# Altium schematic sheet Barrido doble de fuente DC.SchDoc
size A4
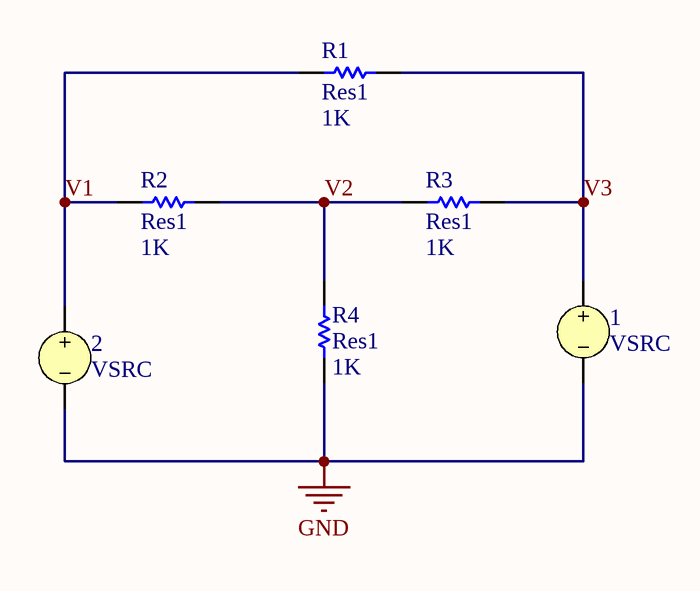
[diagram p0: Barrido doble de fuente DC.SchDoc]

## Parts
1  VSRC
2  VSRC
R1  Res1  value 1K  [AXIAL-0.3]
R2  Res1  value 1K  [AXIAL-0.3]
R3  Res1  value 1K  [AXIAL-0.3]
R4  Res1  value 1K  [AXIAL-0.3]

## Nets
GND: 1.2 2.2 R4.2
V1: 2.1 R1.2 R2.1
V2: R2.2 R3.2 R4.1
V3: 1.1 R1.1 R3.1

## Library data of the parts
1 = VSRC: Voltage Source; Note: PCB Footprint - Not required; Value: +6; Published: 8-Jun-2000; LatestRevisionDate: 17-Jul-2002; LatestRevisionNote: Re-released for DXP Platform.; PackageReference: Not Applicable; Publisher: Altium Limited
2 = VSRC: Voltage Source; Note: PCB Footprint - Not required; Value: +12; Published: 8-Jun-2000; LatestRevisionDate: 17-Jul-2002; LatestRevisionNote: Re-released for DXP Platform.; PackageReference: Not Applicable; Publisher: Altium Limited
R1-R4 = Res1: Resistor; Published: 8-Jun-2000; LatestRevisionDate: 17-Jul-2002; LatestRevisionNote: Re-released for DXP Platform.; PackageReference: AXIAL-0.3; Publisher: Altium Limited; PackageDescription: Axial Device, Thru-Hole; 2 Leads; 0.3 in Pin Spacing